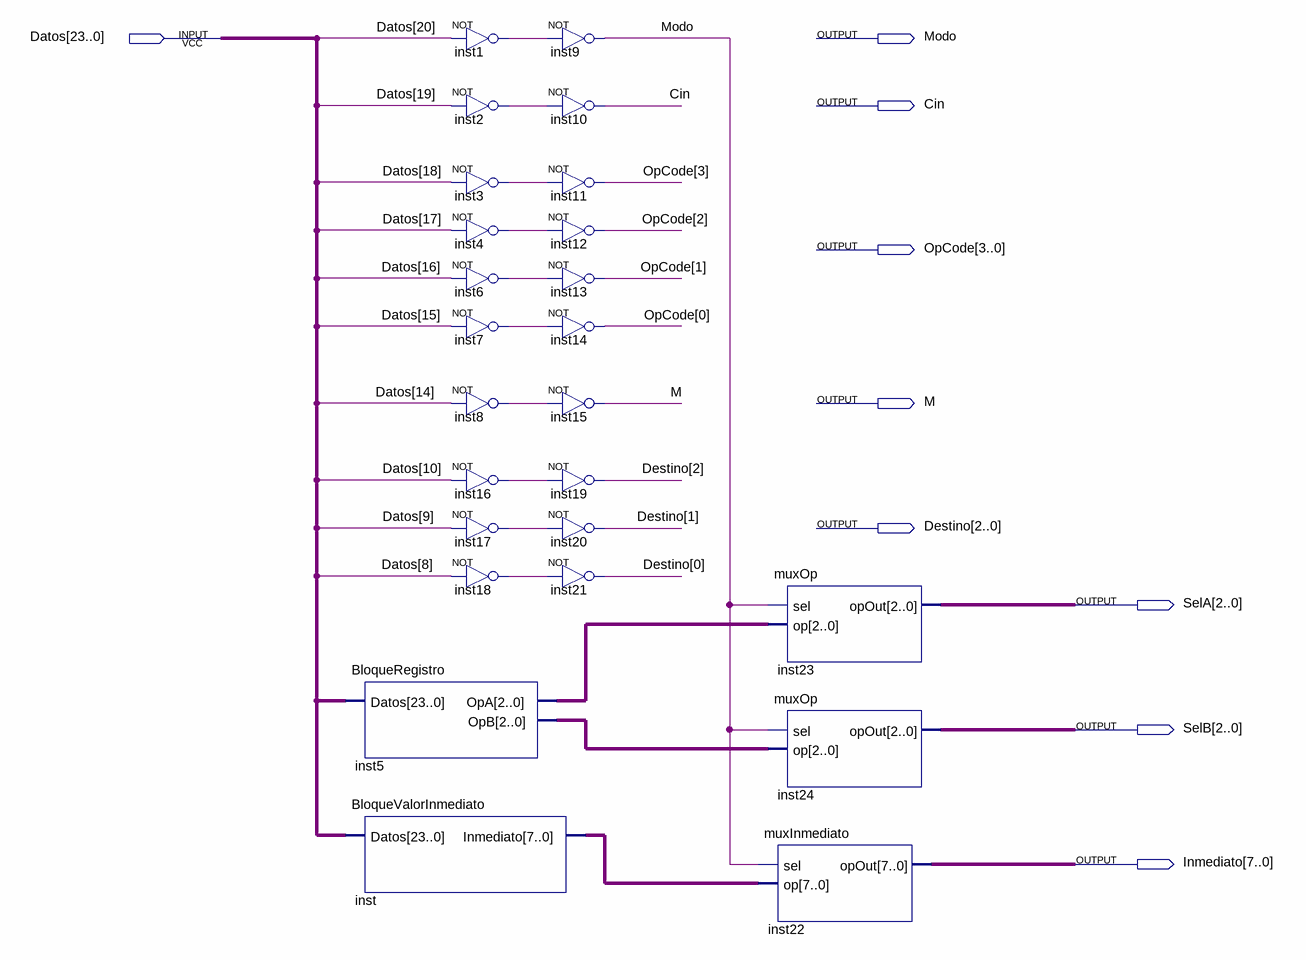
[diagram p0: schematic sheet]
// Quartus schematic UnidadControl.bdf as structural Verilog: 25 symbols, 9 pins
module UnidadControl (
  input  [23:0] Datos,
  output Modo,
  output Cin,
  output [3:0] OpCode,
  output M,
  output [2:0] Destino,
  output [2:0] SelA,
  output [2:0] SelB,
  output [7:0] Inmediato
);

  wire inst1_out, inst2_out, inst3_out, inst4_out, inst6_out, inst7_out, inst8_out, inst16_out, inst17_out,
       inst18_out;
  wire [2:0] inst5_opa, inst5_opb;
  wire [7:0] inst_inmediato;

  BloqueRegistro inst5 (.Datos(Datos), .OpA(inst5_opa), .OpB(inst5_opb));
  BloqueValorInmediato inst (.Datos(Datos), .Inmediato(inst_inmediato));
  not inst1 (inst1_out, Datos[20]);
  not inst2 (inst2_out, Datos[19]);
  not inst3 (inst3_out, Datos[18]);
  not inst4 (inst4_out, Datos[17]);
  not inst6 (inst6_out, Datos[16]);
  not inst7 (inst7_out, Datos[15]);
  not inst8 (inst8_out, Datos[14]);
  not inst16 (inst16_out, Datos[10]);
  not inst17 (inst17_out, Datos[9]);
  not inst18 (inst18_out, Datos[8]);
  not inst9 (Modo, inst1_out);
  not inst10 (Cin, inst2_out);
  not inst11 (OpCode[3], inst3_out);
  not inst12 (OpCode[2], inst4_out);
  not inst13 (OpCode[1], inst6_out);
  not inst14 (OpCode[0], inst7_out);
  not inst15 (M, inst8_out);
  not inst19 (Destino[2], inst16_out);
  not inst20 (Destino[1], inst17_out);
  not inst21 (Destino[0], inst18_out);
  muxOp inst23 (.sel(Modo), .op(inst5_opa), .opOut(SelA));
  muxOp inst24 (.sel(Modo), .op(inst5_opb), .opOut(SelB));
  muxInmediato inst22 (.sel(Modo), .op(inst_inmediato), .opOut(Inmediato));
endmodule
